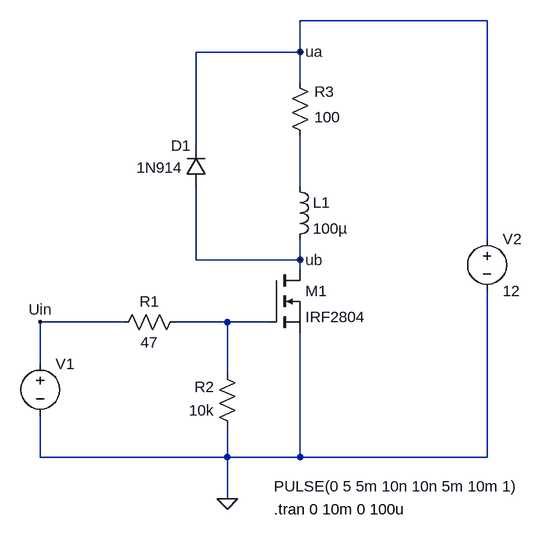
[diagram p0: schematic Draft3.asc]
Draft3.asc, the LTspice schematic file:
Version 4
SHEET 1 880 680
WIRE 672 -368 384 -368
WIRE 384 -320 384 -368
WIRE 384 -320 224 -320
WIRE 384 -272 384 -320
WIRE 224 -176 224 -320
WIRE 384 -112 384 -192
WIRE 672 -32 672 -368
WIRE 224 0 224 -112
WIRE 384 0 384 -32
WIRE 384 0 224 0
WIRE 384 16 384 0
WIRE 112 96 -16 96
WIRE 272 96 192 96
WIRE 336 96 272 96
WIRE -16 160 -16 96
WIRE 272 176 272 96
WIRE -16 304 -16 240
WIRE 272 304 272 256
WIRE 272 304 -16 304
WIRE 384 304 384 112
WIRE 384 304 272 304
WIRE 672 304 672 48
WIRE 672 304 384 304
WIRE 272 368 272 304
FLAG 272 368 0
FLAG 384 0 ub
FLAG 384 -320 ua
FLAG -16 96 Uin
SYMBOL voltage -16 144 R0
WINDOW 3 360 205 Left 2
WINDOW 123 0 0 Left 0
WINDOW 39 0 0 Left 0
SYMATTR Value PULSE(0 5 5m 10n 10n 5m 10m 1)
SYMATTR InstName V1
SYMBOL voltage 672 -48 R0
SYMATTR InstName V2
SYMATTR Value 12
SYMBOL res 208 80 R90
WINDOW 0 0 56 VBottom 2
WINDOW 3 32 56 VTop 2
SYMATTR InstName R1
SYMATTR Value 47
SYMBOL res 288 272 R180
WINDOW 0 36 76 Left 2
WINDOW 3 36 40 Left 2
SYMATTR InstName R2
SYMATTR Value 10k
SYMBOL res 400 -176 R180
WINDOW 0 -37 83 Left 2
WINDOW 3 -47 44 Left 2
SYMATTR InstName R3
SYMATTR Value 100
SYMBOL ind 368 -128 R0
SYMATTR InstName L1
SYMATTR Value 100µ
SYMBOL diode 240 -112 R180
WINDOW 0 24 64 Left 2
WINDOW 3 36 30 Left 2
SYMATTR InstName D1
SYMATTR Value 1N914
SYMBOL nmos 336 16 R0
SYMATTR InstName M1
SYMATTR Value IRF2804
TEXT 344 384 Left 2 !.tran 0 10m 0 100u

The netlist it stands for:
* Draft3.asc
V1 Uin 0 PULSE(0 5 5m 10n 10n 5m 10m 1)
V2 ua 0 12
R1 N002 Uin 47
R2 0 N002 10k
R3 N001 ua 100
L1 N001 ub 100µ
D1 ub ua 1N914
M1 ub N002 0 0 IRF2804
.model D D
.lib standard.dio
.model NMOS NMOS
.model PMOS PMOS
.lib standard.mos
.tran 0 10m 0 100u
.backanno
.end

* Results of the author's LTspice run, read from the files saved beside the schematic
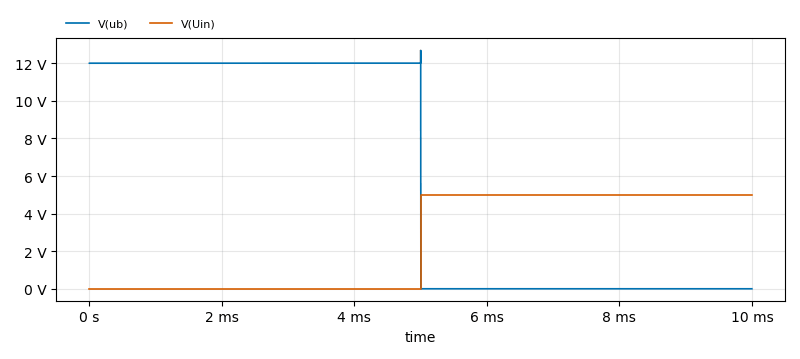
[diagram p1: Transient Analysis of Draft3.asc, plotted from the saved traces]
* Transient Analysis, 1 run:
*   V(ub): min 1.302 mV, max 12.68 V, average 6.002 V, rms 8.486 V, last 1.31 mV
*   V(Uin): min 0 V, max 5 V, average 2.5 V, rms 3.536 V, last 5 V